# EAGLE schematic ife19_TS_BMS_v2_Eagle (EAGLE 9.2.2)

## Sheet 1 of 4
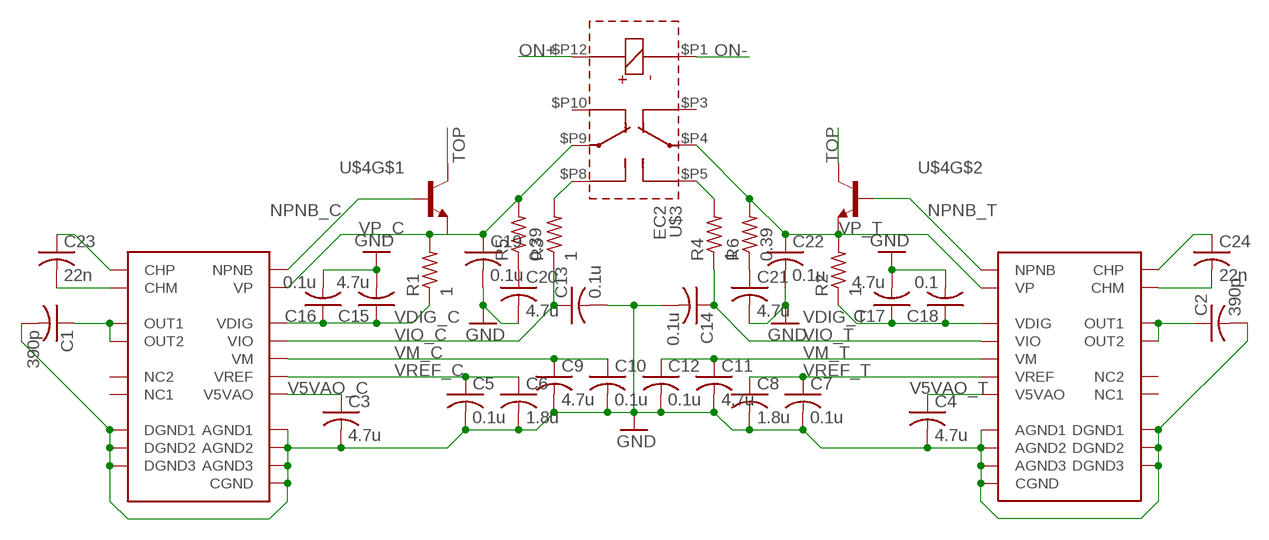
[diagram p0: schematic, sheet 1]

### Parts
C  BQ76PL455A  [TQFP80]
C1  390p  C-USC0603K  [C0603K]
C2  390p  C-USC0603K  [C0603K]
C3  4.7u  C-USC0603K  [C0603K]
C4  4.7u  C-USC0603K  [C0603K]
C5  0.1u  C-USC0603K  [C0603K]
C6  1.8u  C-USC0603K  [C0603K]
C7  0.1u  C-USC0603K  [C0603K]
C8  1.8u  C-USC0603K  [C0603K]
C9  4.7u  C-USC0603K  [C0603K]
C10  0.1u  C-USC0603K  [C0603K]
C11  4.7u  C-USC0603K  [C0603K]
C12  0.1u  C-USC0603K  [C0603K]
C13  0.1u  C-USC0603K  [C0603K]
C14  0.1u  C-USC0603K  [C0603K]
C15  4.7u  C-USC0603K  [C0603K]
C16  0.1u  C-USC0603K  [C0603K]
C17  4.7u  C-USC0603K  [C0603K]
C18  0.1  C-USC0603K  [C0603K]
C19  0.1u  C-USC0603K  [C0603K]
C20  4.7u  C-USC0603K  [C0603K]
C21  4.7u  C-USC0603K  [C0603K]
C22  0.1u  C-USC0603K  [C0603K]
C23  22n  C-USC0603  [C0603]
C24  22n  C-USC0603  [C0603]
R1  1  R-US_R0603  [R0603]
R2  1  R-US_R0603  [R0603]
R3  1  R-US_R0603  [R0603]
R4  1  R-US_R0603  [R0603]
R5  0.39  R-US_R0603  [R0603]
R6  0.39  R-US_R0603  [R0603]
T  BQ76PL455A  [TQFP80]
U$3  EC2  [DPDT_2.54]
U$4  PHPT610030NK  [LFPAK56D]

### Nets
GND: C1.2 C2.2 C3.2 C4.2 C5.2 C6.2 C7.2 C8.2 C9.2 C10.2 C11.2 C12.2 C13.2 C14.2 C15.2 C16.2 C17.2 C18.2 C19.2 C20.2 C21.2 C22.2 C.30(PWR:DGND1) C.35(PWR:DGND2) C.37(PWR:DGND3) C.48(PWR:CGND) C.69(PWR:AGND3) C.72(PWR:AGND2) C.74(PWR:AGND1) T.30(PWR:DGND1) T.35(PWR:DGND2) T.37(PWR:DGND3) T.48(PWR:CGND) T.69(PWR:AGND3) T.72(PWR:AGND2) T.74(PWR:AGND1) ; also sheet 2,3
N$1: C23.1 C.32(PWR:CHP)
N$2: C23.2 C.33(PWR:CHM)
N$3: C1.1 C.68(PWR:OUT2) C.73(PWR:OUT1)
N$4: C2.1 T.68(PWR:OUT2) T.73(PWR:OUT1)
N$5: C24.1 T.32(PWR:CHP)
N$6: C24.2 T.33(PWR:CHM)
N$7: R3.2 U$3.$P8
N$8: R4.2 U$3.$P5
N$20: C20.1 R5.1
N$21: C21.1 R6.1
NPNB_C: C.71(PWR:NPNB) U$4.B1(B)
NPNB_T: T.71(PWR:NPNB) U$4.B2(B)
ON+: U$3.$P12 ; also sheet 3
ON-: U$3.$P1 ; also sheet 3
TOP: U$4.C1(C) U$4.C2(C)
V5VAO_C: C3.1 C.58(PWR:V5VAO)
V5VAO_T: C4.1 T.58(PWR:V5VAO)
VDIG_C: C15.1 C16.1 C.34(PWR:VDIG) R1.1
VDIG_T: C17.1 C18.1 R2.1 T.34(PWR:VDIG)
VIO_C: C13.1 C.41(PWR:VIO) R3.1
VIO_T: C14.1 R4.1 T.41(PWR:VIO)
VM_C: C9.1 C10.1 C.31(PWR:VM)
VM_T: C11.1 C12.1 T.31(PWR:VM)
VP_C: C19.1 C.70(PWR:VP) R1.2 R5.2 U$3.$P9 U$4.E1(E)
VP_T: C22.1 R2.2 R6.2 T.70(PWR:VP) U$3.$P4 U$4.E2(E)
VREF_C: C5.1 C6.1 C.67(PWR:VREF)
VREF_T: C7.1 C8.1 T.67(PWR:VREF)
Unconnected: C.36(PWR:NC1) C.75(PWR:NC2) T.36(PWR:NC1) T.75(PWR:NC2) U$3.$P3 U$3.$P10

## Sheet 2 of 4
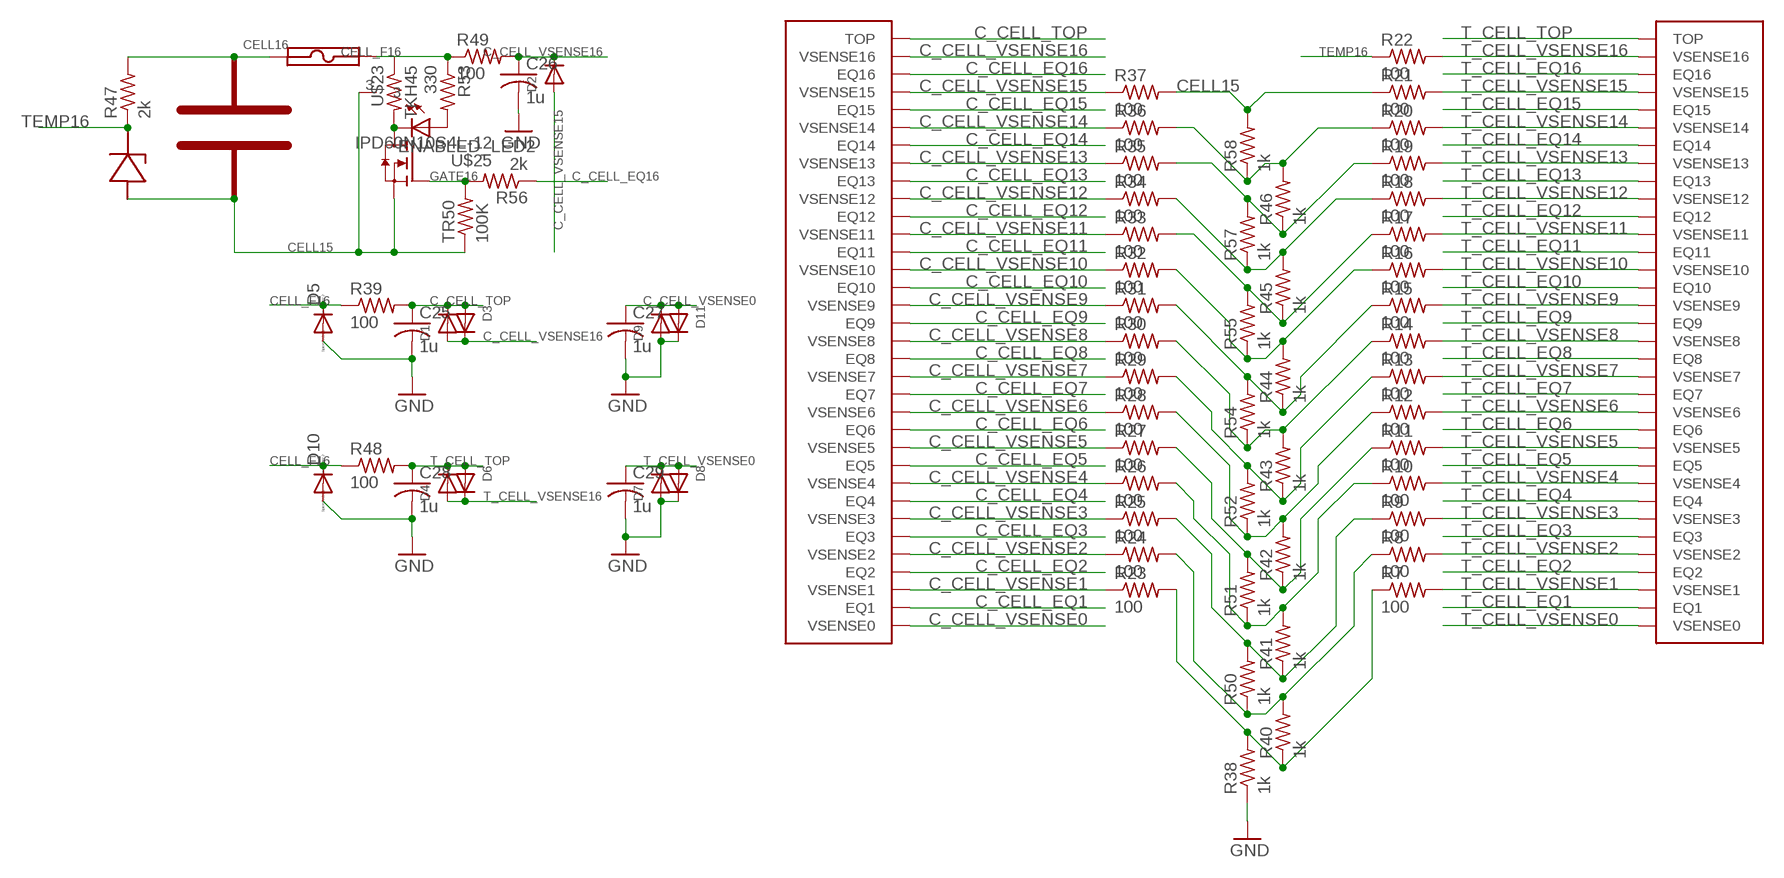
[diagram p1: schematic, sheet 2]

### Parts
C25  1u  C-USC0603K  [C0603K]
C26  1u  C-USC0603K  [C0603K]
C27  1u  C-USC0603K  [C0603K]
C28  1u  C-USC0603K  [C0603K]
C29  1u  C-USC0603K  [C0603K]
D1  DIODESOD-123  [SOD-123]
D2  DIODESOD-123  [SOD-123]
D3  DIODESOD-123  [SOD-123]
D4  DIODESOD-123  [SOD-123]
D5  DIODE-DO214AC  [DO214AC]
D6  DIODESOD-123  [SOD-123]
D7  DIODESOD-123  [SOD-123]
D8  DIODESOD-123  [SOD-123]
D9  DIODESOD-123  [SOD-123]
D10  DIODE-DO214AC  [DO214AC]
D11  DIODESOD-123  [SOD-123]
ENABLED_LED2  LEDCHIPLED_0603  [CHIPLED_0603]
R7  100  R-US_R0603  [R0603]
R8  100  R-US_R0603  [R0603]
R9  100  R-US_R0603  [R0603]
R10  100  R-US_R0603  [R0603]
R11  100  R-US_R0603  [R0603]
R12  100  R-US_R0603  [R0603]
R13  100  R-US_R0603  [R0603]
R14  100  R-US_R0603  [R0603]
R15  100  R-US_R0603  [R0603]
R16  100  R-US_R0603  [R0603]
R17  100  R-US_R0603  [R0603]
R18  100  R-US_R0603  [R0603]
R19  100  R-US_R0603  [R0603]
R20  100  R-US_R0603  [R0603]
R21  100  R-US_R0603  [R0603]
R22  100  R-US_R0603  [R0603]
R23  100  R-US_R0603  [R0603]
R24  100  R-US_R0603  [R0603]
R25  100  R-US_R0603  [R0603]
R26  100  R-US_R0603  [R0603]
R27  100  R-US_R0603  [R0603]
R28  100  R-US_R0603  [R0603]
R29  100  R-US_R0603  [R0603]
R30  100  R-US_R0603  [R0603]
R31  100  R-US_R0603  [R0603]
R32  100  R-US_R0603  [R0603]
R33  100  R-US_R0603  [R0603]
R34  100  R-US_R0603  [R0603]
R35  100  R-US_R0603  [R0603]
R36  100  R-US_R0603  [R0603]
R37  100  R-US_R0603  [R0603]
R38  1k  R-US_R0603  [R0603]
R39  100  R-US_R0603  [R0603]
R40  1k  R-US_R0603  [R0603]
R41  1k  R-US_R0603  [R0603]
R42  1k  R-US_R0603  [R0603]
R43  1k  R-US_R0603  [R0603]
R44  1k  R-US_R0603  [R0603]
R45  1k  R-US_R0603  [R0603]
R46  1k  R-US_R0603  [R0603]
R47  2k  R-US_R0603  [R0603]
R48  100  R-US_R0603  [R0603]
R49  100  R-US_R0603  [R0603]
R50  1k  R-US_R0603  [R0603]
R51  1k  R-US_R0603  [R0603]
R52  1k  R-US_R0603  [R0603]
R53  330  R-US_R0603  [R0603]
R54  1k  R-US_R0603  [R0603]
R55  1k  R-US_R0603  [R0603]
R56  2k  R-US_R0603  [R0603]
R57  1k  R-US_R0603  [R0603]
R58  1k  R-US_R0603  [R0603]
TR50  100K  R-US_R0603  [R0603]
U$1  LI6PT  [6PT]
U$22  SF-0603FP  [0603]
U$23  TKH45  [TO252-TKH-45]
U$25  IPD60N10S4L-12  [TO252]

### Nets
C_CELL_EQ1: C.28(CELL:EQ1)
C_CELL_EQ2: C.26(CELL:EQ2)
C_CELL_EQ3: C.24(CELL:EQ3)
C_CELL_EQ4: C.22(CELL:EQ4)
C_CELL_EQ5: C.20(CELL:EQ5)
C_CELL_EQ6: C.18(CELL:EQ6)
C_CELL_EQ7: C.16(CELL:EQ7)
C_CELL_EQ8: C.14(CELL:EQ8)
C_CELL_EQ9: C.12(CELL:EQ9)
C_CELL_EQ10: C.10(CELL:EQ10)
C_CELL_EQ11: C.8(CELL:EQ11)
C_CELL_EQ12: C.6(CELL:EQ12)
C_CELL_EQ13: C.4(CELL:EQ13)
C_CELL_EQ14: C.2(CELL:EQ14)
C_CELL_EQ15: C.80(CELL:EQ15)
C_CELL_EQ16: C.78(CELL:EQ16) R56.1
C_CELL_TOP: C25.1 C.76(CELL:TOP) D1.C D3.A R39.2
C_CELL_VSENSE0: C27.1 C.29(CELL:VSENSE0) D9.C D11.A
C_CELL_VSENSE1: C.27(CELL:VSENSE1) R23.1
C_CELL_VSENSE2: C.25(CELL:VSENSE2) R24.1
C_CELL_VSENSE3: C.23(CELL:VSENSE3) R25.1
C_CELL_VSENSE4: C.21(CELL:VSENSE4) R26.1
C_CELL_VSENSE5: C.19(CELL:VSENSE5) R27.1
C_CELL_VSENSE6: C.17(CELL:VSENSE6) R28.1
C_CELL_VSENSE7: C.15(CELL:VSENSE7) R29.1
C_CELL_VSENSE8: C.13(CELL:VSENSE8) R30.1
C_CELL_VSENSE9: C.11(CELL:VSENSE9) R31.1
C_CELL_VSENSE10: C.9(CELL:VSENSE10) R32.1
C_CELL_VSENSE11: C.7(CELL:VSENSE11) R33.1
C_CELL_VSENSE12: C.5(CELL:VSENSE12) R34.1
C_CELL_VSENSE13: C.3(CELL:VSENSE13) R35.1
C_CELL_VSENSE14: C.1(CELL:VSENSE14) R36.1
C_CELL_VSENSE15: C.79(CELL:VSENSE15) D2.A R37.1
C_CELL_VSENSE16: C26.1 C.77(CELL:VSENSE16) D1.A D2.C D3.C R49.2
CELL15: R21.1 R37.2 R58.2 TR50.1 U$1.1(TEMP-) U$1.CELLH-(CELL-) U$1.CELLP-(CELL-) U$23.3 U$25.3(S)
CELL16: R47.2 U$1.CELLH+(CELL+) U$1.CELLP+(CELL+) U$22.1
CELL_F16: D5.C D10.C R39.1 R48.1 R49.1 R53.1 U$22.2 U$23.1
GATE16: R56.2 TR50.2 U$25.1(G)
GND: C25.2 C26.2 C27.2 C28.2 C29.2 D5.A D7.A D8.C D9.A D10.A D11.C R38.1 ; also sheet 1,3
N$11: R20.1 R36.2 R46.2 R58.1
N$12: R19.1 R35.2 R46.1 R57.2
N$13: R18.1 R34.2 R45.2 R57.1
N$14: R17.1 R33.2 R45.1 R55.2
N$15: R16.1 R32.2 R44.2 R55.1
N$16: R15.1 R31.2 R44.1 R54.2
N$17: R14.1 R30.2 R43.2 R54.1
N$18: R13.1 R29.2 R43.1 R52.2
N$19: R12.1 R28.2 R42.2 R52.1
N$22: R11.1 R27.2 R42.1 R51.2
N$23: R10.1 R26.2 R41.2 R51.1
N$24: R9.1 R25.2 R41.1 R50.2
N$25: R8.1 R24.2 R40.2 R50.1
N$26: R7.1 R23.2 R38.2 R40.1
N$29: ENABLED_LED2.A R53.2
N$41: ENABLED_LED2.C U$23.2 U$25.2(D)
T_CELL_EQ1: T.28(CELL:EQ1)
T_CELL_EQ2: T.26(CELL:EQ2)
T_CELL_EQ3: T.24(CELL:EQ3)
T_CELL_EQ4: T.22(CELL:EQ4)
T_CELL_EQ5: T.20(CELL:EQ5)
T_CELL_EQ6: T.18(CELL:EQ6)
T_CELL_EQ7: T.16(CELL:EQ7)
T_CELL_EQ8: T.14(CELL:EQ8)
T_CELL_EQ9: T.12(CELL:EQ9)
T_CELL_EQ10: T.10(CELL:EQ10)
T_CELL_EQ11: T.8(CELL:EQ11)
T_CELL_EQ12: T.6(CELL:EQ12)
T_CELL_EQ13: T.4(CELL:EQ13)
T_CELL_EQ14: T.2(CELL:EQ14)
T_CELL_EQ15: T.80(CELL:EQ15)
T_CELL_EQ16: T.78(CELL:EQ16)
T_CELL_TOP: C28.1 D4.C D6.A R48.2 T.76(CELL:TOP)
T_CELL_VSENSE0: C29.1 D7.C D8.A T.29(CELL:VSENSE0)
T_CELL_VSENSE1: R7.2 T.27(CELL:VSENSE1)
T_CELL_VSENSE2: R8.2 T.25(CELL:VSENSE2)
T_CELL_VSENSE3: R9.2 T.23(CELL:VSENSE3)
T_CELL_VSENSE4: R10.2 T.21(CELL:VSENSE4)
T_CELL_VSENSE5: R11.2 T.19(CELL:VSENSE5)
T_CELL_VSENSE6: R12.2 T.17(CELL:VSENSE6)
T_CELL_VSENSE7: R13.2 T.15(CELL:VSENSE7)
T_CELL_VSENSE8: R14.2 T.13(CELL:VSENSE8)
T_CELL_VSENSE9: R15.2 T.11(CELL:VSENSE9)
T_CELL_VSENSE10: R16.2 T.9(CELL:VSENSE10)
T_CELL_VSENSE11: R17.2 T.7(CELL:VSENSE11)
T_CELL_VSENSE12: R18.2 T.5(CELL:VSENSE12)
T_CELL_VSENSE13: R19.2 T.3(CELL:VSENSE13)
T_CELL_VSENSE14: R20.2 T.1(CELL:VSENSE14)
T_CELL_VSENSE15: R21.2 T.79(CELL:VSENSE15)
T_CELL_VSENSE16: D4.A D6.C R22.2 T.77(CELL:VSENSE16)
TEMP16: R22.1 R47.1 U$1.2(TEMP+)

## Sheet 3 of 4
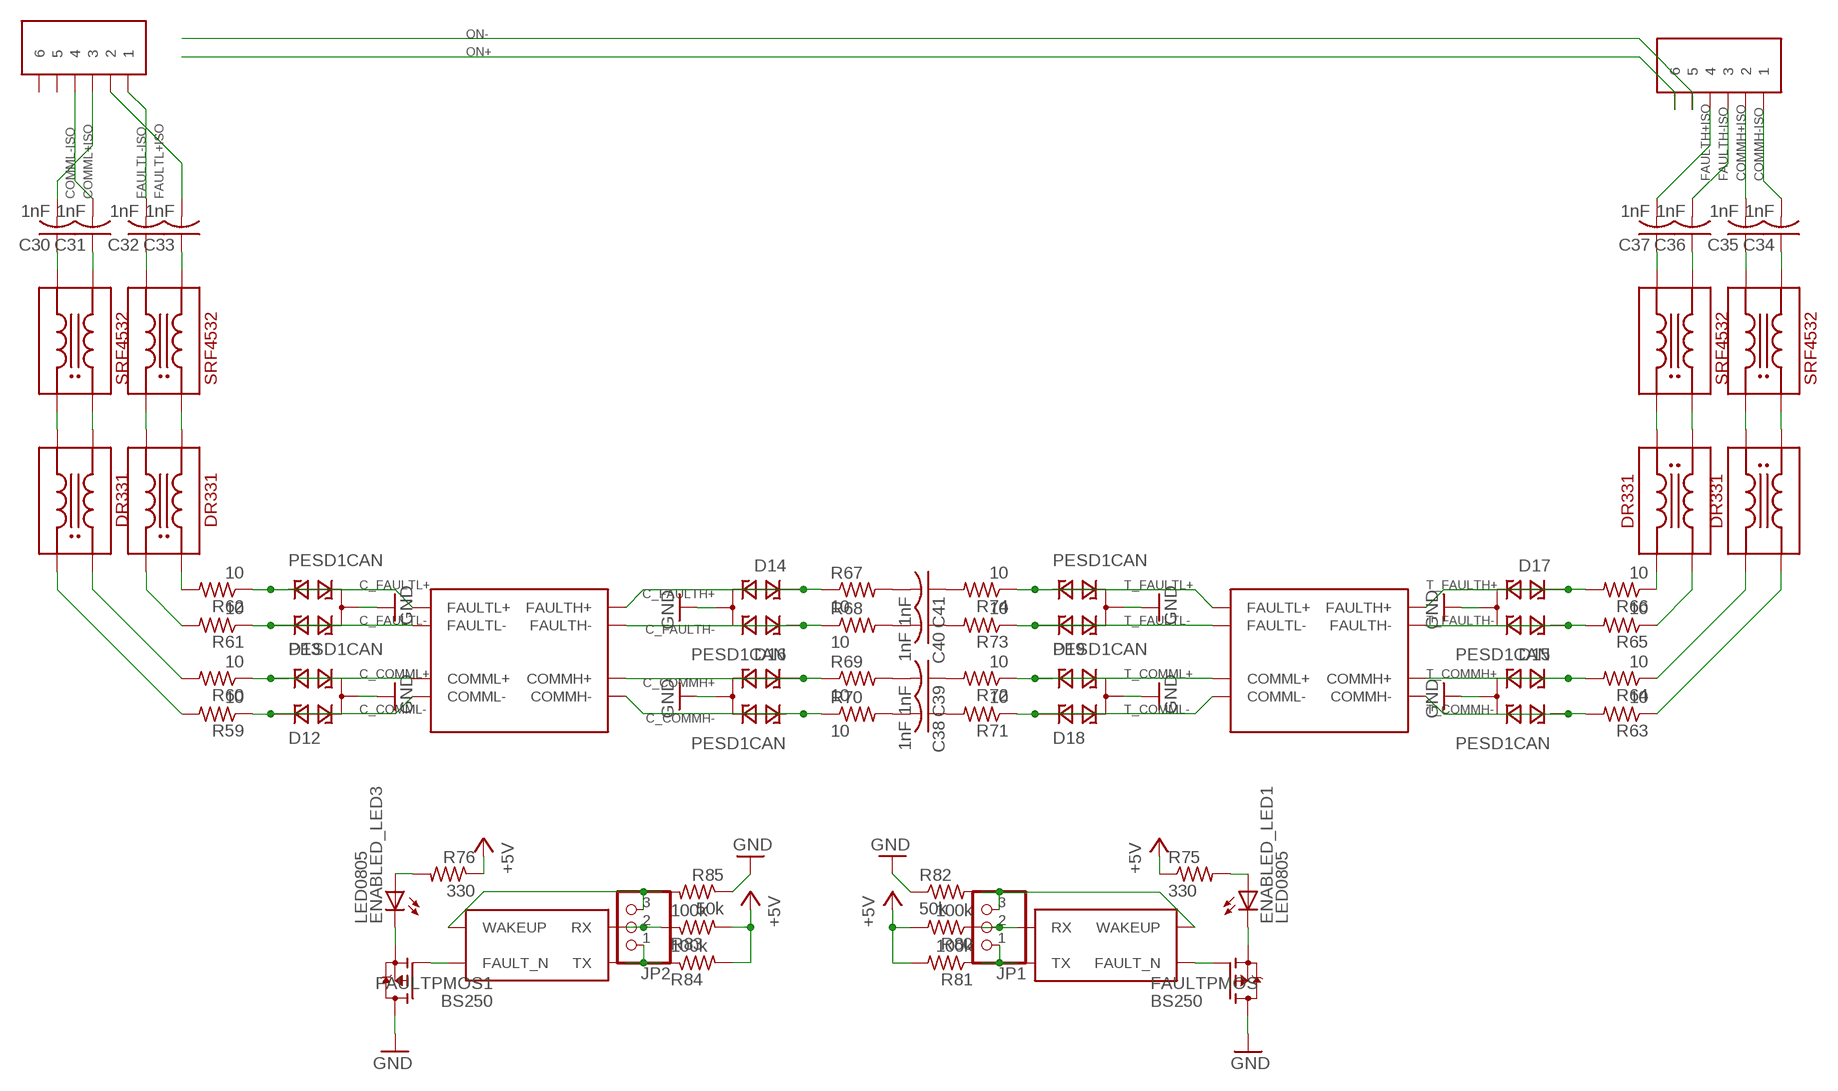
[diagram p2: schematic, sheet 3]

### Parts
C30  1nF  C-USC0805  [C0805]
C31  1nF  C-USC0805  [C0805]
C32  1nF  C-USC0805  [C0805]
C33  1nF  C-USC0805  [C0805]
C34  1nF  C-USC0805  [C0805]
C35  1nF  C-USC0805  [C0805]
C36  1nF  C-USC0805  [C0805]
C37  1nF  C-USC0805  [C0805]
C38  1nF  C-USC0805  [C0805]
C39  1nF  C-USC0805  [C0805]
C40  1nF  C-USC0805  [C0805]
C41  1nF  C-USC0805  [C0805]
D12  PESD1CAN  [SOT23]
D13  PESD1CAN  [SOT23]
D14  PESD1CAN  [SOT23]
D15  PESD1CAN  [SOT23]
D16  PESD1CAN  [SOT23]
D17  PESD1CAN  [SOT23]
D18  PESD1CAN  [SOT23]
D19  PESD1CAN  [SOT23]
ENABLED_LED1  LED0805  [LED0805]
ENABLED_LED3  LED0805  [LED0805]
FAULTPMOS  BS250  [SOT23]
FAULTPMOS1  BS250  [SOT23]
JP1  PINHD-1X3CB  [1X03-CLEANBIG]
JP2  PINHD-1X3CB  [1X03-CLEANBIG]
R59  10  R-US_R0805  [R0805]
R60  10  R-US_R0805  [R0805]
R61  10  R-US_R0805  [R0805]
R62  10  R-US_R0805  [R0805]
R63  10  R-US_R0805  [R0805]
R64  10  R-US_R0805  [R0805]
R65  10  R-US_R0805  [R0805]
R66  10  R-US_R0805  [R0805]
R67  10  R-US_R0805  [R0805]
R68  10  R-US_R0805  [R0805]
R69  10  R-US_R0805  [R0805]
R70  10  R-US_R0805  [R0805]
R71  10  R-US_R0805  [R0805]
R72  10  R-US_R0805  [R0805]
R73  10  R-US_R0805  [R0805]
R74  10  R-US_R0805  [R0805]
R75  330  R-US_R0805  [R0805]
R76  330  R-US_R0805  [R0805]
R80  100k  R-US_R0805  [R0805]
R81  100k  R-US_R0805  [R0805]
R82  50k  R-US_R0805  [R0805]
R83  100k  R-US_R0805  [R0805]
R84  100k  R-US_R0805  [R0805]
R85  50k  R-US_R0805  [R0805]
U$2  SRF5432  [SRF5432]
U$5  MICROFIT3.0-3P  [6POS-3MM]
U$6  SRF5432  [SRF5432]
U$7  MICROFIT3.0-3P  [6POS-3MM]
U$8  SRF5432  [SRF5432]
U$9  SRF5432  [SRF5432]
U$10  DR331  [DR331]
U$12  DR331  [DR331]
U$14  DR331  [DR331]
U$16  DR331  [DR331]

### Nets
C_COMMH+: C.55(DIFFCOMM:COMMH+) D16.1 R69.1
C_COMMH-: C.54(DIFFCOMM:COMMH-) D16.2 R70.1
C_COMML+: C.52(DIFFCOMM:COMML+) D12.2 R60.1
C_COMML-: C.53(DIFFCOMM:COMML-) D12.1 R59.1
C_FAULTH+: C.57(DIFFCOMM:FAULTH+) D14.1 R67.1
C_FAULTH-: C.56(DIFFCOMM:FAULTH-) D14.2 R68.1
C_FAULTL+: C.50(DIFFCOMM:FAULTL+) D13.2 R62.1
C_FAULTL-: C.51(DIFFCOMM:FAULTL-) D13.1 R61.1
COMMH+ISO: C35.2 U$7.P$2
COMMH-ISO: C34.2 U$7.P$1
COMML+ISO: C31.2 U$5.P$4
COMML-ISO: C30.2 U$5.P$3
FAULT_N: FAULTPMOS.1(G) T.40(COMM:FAULT_N)
FAULTH+ISO: C37.2 U$7.P$4
FAULTH-ISO: C36.2 U$7.P$3
FAULTL+ISO: C33.2 U$5.P$2
FAULTL-ISO: C32.2 U$5.P$1
GND: D12.3 D13.3 D14.3 D15.3 D16.3 D17.3 D18.3 D19.3 FAULTPMOS1.3(D) FAULTPMOS.3(D) R82.1 R85.1 ; also sheet 1,2
N$9: C30.1 U$2.P$3
N$10: C31.1 U$2.P$2
N$27: C32.1 U$6.P$3
N$28: C33.1 U$6.P$2
N$30: C34.1 U$9.P$2
N$31: C35.1 U$9.P$3
N$32: C36.1 U$8.P$2
N$33: C37.1 U$8.P$3
N$34: U$9.P$4 U$14.P$2
N$35: U$9.P$1 U$14.P$1
N$36: U$8.P$4 U$16.P$2
N$37: U$8.P$1 U$16.P$1
N$38: U$2.P$1 U$10.P$3
N$39: U$2.P$4 U$10.P$4
N$40: U$6.P$1 U$12.P$3
N$42: U$6.P$4 U$12.P$4
N$43: R62.2 U$12.P$2
N$44: R66.1 U$16.P$3
N$45: R61.2 U$12.P$1
N$46: R60.2 U$10.P$2
N$47: R59.2 U$10.P$1
N$48: R65.1 U$16.P$4
N$49: R64.1 U$14.P$3
N$50: R63.1 U$14.P$4
N$51: C41.2 R67.2
N$52: C40.2 R68.2
N$53: C39.2 R69.2
N$54: C38.2 R70.2
N$55: C38.1 R71.2
N$56: C39.1 R72.2
N$57: C40.1 R73.2
N$58: C41.1 R74.2
N$59: ENABLED_LED1.2(C) FAULTPMOS.2(S)
N$60: ENABLED_LED1.1(A) R75.2
N$61: ENABLED_LED3.2(C) FAULTPMOS1.2(S)
N$62: ENABLED_LED3.1(A) R76.2
N$63: C.40(COMM:FAULT_N) FAULTPMOS1.1(G)
N$67: JP1.1 R81.1 T.38(COMM:TX)
N$68: JP1.3 R82.2 T.49(COMM:WAKEUP)
N$69: JP1.2 R80.1 T.39(COMM:RX)
N$70: C.38(COMM:TX) JP2.1 R84.1
N$71: C.49(COMM:WAKEUP) JP2.3 R85.2
N$72: C.39(COMM:RX) JP2.2 R83.1
ON+: U$7.P$6 ; also sheet 1
ON-: U$7.P$5 ; also sheet 1
T_COMMH+: D15.1 R64.2 T.55(DIFFCOMM:COMMH+)
T_COMMH-: D15.2 R63.2 T.54(DIFFCOMM:COMMH-)
T_COMML+: D18.2 R72.1 T.52(DIFFCOMM:COMML+)
T_COMML-: D18.1 R71.1 T.53(DIFFCOMM:COMML-)
T_FAULTH+: D17.1 R66.2 T.57(DIFFCOMM:FAULTH+)
T_FAULTH-: D17.2 R65.2 T.56(DIFFCOMM:FAULTH-)
T_FAULTL+: D19.2 R74.1 T.50(DIFFCOMM:FAULTL+)
T_FAULTL-: D19.1 R73.1 T.51(DIFFCOMM:FAULTL-)
VIO: R75.1 R76.1 R80.2 R81.2 R83.2 R84.2 ; supply symbol labelled +5V
Unconnected: U$5.P$5 U$5.P$6

## Sheet 4 of 4
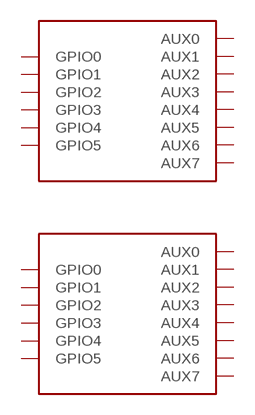
[diagram p3: schematic, sheet 4]
Unconnected: C.42(GPIO:GPIO5) C.43(GPIO:GPIO4) C.44(GPIO:GPIO3) C.45(GPIO:GPIO2) C.46(GPIO:GPIO1) C.47(GPIO:GPIO0) C.59(GPIO:AUX7) C.60(GPIO:AUX6) C.61(GPIO:AUX5) C.62(GPIO:AUX4) C.63(GPIO:AUX3) C.64(GPIO:AUX2) C.65(GPIO:AUX1) C.66(GPIO:AUX0) T.42(GPIO:GPIO5) T.43(GPIO:GPIO4) T.44(GPIO:GPIO3) T.45(GPIO:GPIO2) T.46(GPIO:GPIO1) T.47(GPIO:GPIO0) T.59(GPIO:AUX7) T.60(GPIO:AUX6) T.61(GPIO:AUX5) T.62(GPIO:AUX4) T.63(GPIO:AUX3) T.64(GPIO:AUX2) T.65(GPIO:AUX1) T.66(GPIO:AUX0)

## Library data of the parts
C T = bq76pl455a:BQ76PL455A
C1-C41 = rcl:C-US: CAPACITOR, American symbol; SPICEPREFIX: C
D1-D4 D6-D9 D11 = adafruit:DIODE: Diode SMADIODE - SMA Surface Mount Package 20V 1A Schottky Diode Digikey: 641-1014-6-ND DO-1N4148 - Through Hole Small Current Diode SOD-123 20V 1 A (.5mV Vf) Schottky Diode - Digikey: MBRX120TPMSCT-ND SOD-323 10V 570mA (.38mV Vf, 3ns) Schottky Diode - Digikey: ZLLS410CT-ND SOD-523 30V 30mA Schottky Diode (RB751S-40TE61) - Digikey: RB751S-40TE61CT-ND SOT23-R/W - SOT23 Package (R = Solder Paste/Reflow Ovens, W = Hand-Soldering) BAT54Film 40V 300mA - Digikey: 497-7162-1-ND
D5 D10 = diode:DIODE-: DIODE
D12-D19 = diode:PESD1CAN: CAN bus ESD protection diode Source: http://www.nxp.com/documents/data_sheet/PESD1CAN.pdf
ENABLED_LED1 ENABLED_LED3 = LEDS:LED0805
ENABLED_LED2 = led:LED: LED OSRAM: - CHIPLED LG R971, LG N971, LY N971, LG Q971, LY Q971, LO R971, LY R971 LH N974, LH R974 LS Q976, LO Q976, LY Q976 LO Q996 - Hyper CHIPLED LW Q18S LB Q993, LB Q99A, LB R99A - SideLED LS A670, LO A670, LY A670, LG A670, LP A670 LB A673, LV A673, LT A673, LW A673 LH A674 LY A675 LS A676, LA A676, LO A676, LY A676, LW A676 LS A679, LY A679, LG A679 - Hyper Micro SIDELED® LS Y876, LA Y876, LO Y876, LY Y876 LT Y87S - SmartLED LW L88C, LW L88S LB L89C, LB L89S, LG L890 LS L89K, LO L89K, LY L89K LS L896, LA L896, LO L896, LY L896 - TOPLED LS T670, LO T670, LY T670, LG T670, LP T670 LSG T670, LSP T670, LSY T670, LOP T670, LYG T670 LG T671, LOG T671, LSG T671 LB T673, LV T673, LT T673, LW T673 LH T674 LS T676, LA T676, LO T676, LY T676, LB T676, LH T676, LSB T676, LW T676 LB T67C, LV T67C, LT T67C, LS T67K, LO T67K, LY T67K, LW E67C LS E67B, LA E67B, LO E67B, LY E67B, LB E67C, LV E67C, LT E67C LW T67C LS T679, LY T679, LG T679 LS T770, LO T770, LY T770, LG T770, LP T770 LB T773, LV T773, LT T773, LW T773 LH T774 LS E675, LA E675, LY E675, LS T675 LS T776, LA T776, LO T776, LY T776, LB T776 LHGB T686 LT T68C, LB T68C - Hyper Mini TOPLED® LB M676 - Mini TOPLED Santana® LG M470 LS M47K, LO M47K, LY M47K Source: http://www.osram.convergy.de LUXEON: - LUMILED® LXK2-PW12-R00, LXK2-PW12-S00, LXK2-PW14-U00, LXK2-PW14-V00 LXK2-PM12-R00, LXK2-PM12-S00, LXK2-PM14-U00 LXK2-PE12-Q00, LXK2-PE12-R00, LXK2-PE12-S00, LXK2-PE14-T00, LXK2-PE14-U00 LXK2-PB12-K00, LXK2-PB12-L00, LXK2-PB12-M00, LXK2-PB14-N00, LXK2-PB14-P00, LXK2-PB14-Q00 LXK2-PR12-L00, LXK2-PR12-M00, LXK2-PR14-Q00, LXK2-PR14-R00 LXK2-PD12-Q00, LXK2-PD12-R00, LXK2-PD12-S00 LXK2-PH12-R00, LXK2-PH12-S00 LXK2-PL12-P00, LXK2-PL12-Q00, LXK2-PL12-R00 Source: www.luxeon.com KINGBRIGHT: KA-3528ASYC Source: www.kingbright.com
FAULTPMOS FAULTPMOS1 = TRANS:BS250: BS250FTA P-Channel Vgs(th) = 3.5V, Rds(on) = 14 ohm, Vds(max) = 45V
JP1 JP2 = adafruit:PINHD-1X3: PIN HEADER
R1-R76 R80-R85 TR50 = rcl:R-US_: RESISTOR, American symbol; SPICEPREFIX: R
U$1 = IFE_Energus:LI6PT
U$2 U$6 U$8 U$9 = Chokes:SRF5432
U$3 = KEMET:EC2: KEMET EC2 DPDT General Purpose 2A Relay. 12V coil voltage. Datasheet <https://content.kemet.com/datasheets/KEM_R7002_EC2_EE2.pdf> Digikey <https://www.digikey.com/product-detail/en/kemet/EC2-12TNU/399-11031-5-ND/4291097>
U$4 = IFE_Transistors:PHPT610030NK
U$5 U$7 = Molex:MICROFIT3.0-3P
U$10 U$12 U$14 U$16 = Chokes:DR331
U$22 = IFE_Fuses:SF-0603FP
U$23 = IFE_Resistors:TKH45
U$25 = IFE_Transistors:IPD60N10S4L-12